# Altium project MiniPC MB GOST.PrjPcb (part 19 of 31)

## Sheet Ethernet HPS Connector.SchDoc
size 209 x 297 mm; Author: ALTIUM GOSTBOM2.0 KEV; SheetNumber: 11; SheetTotal: 48
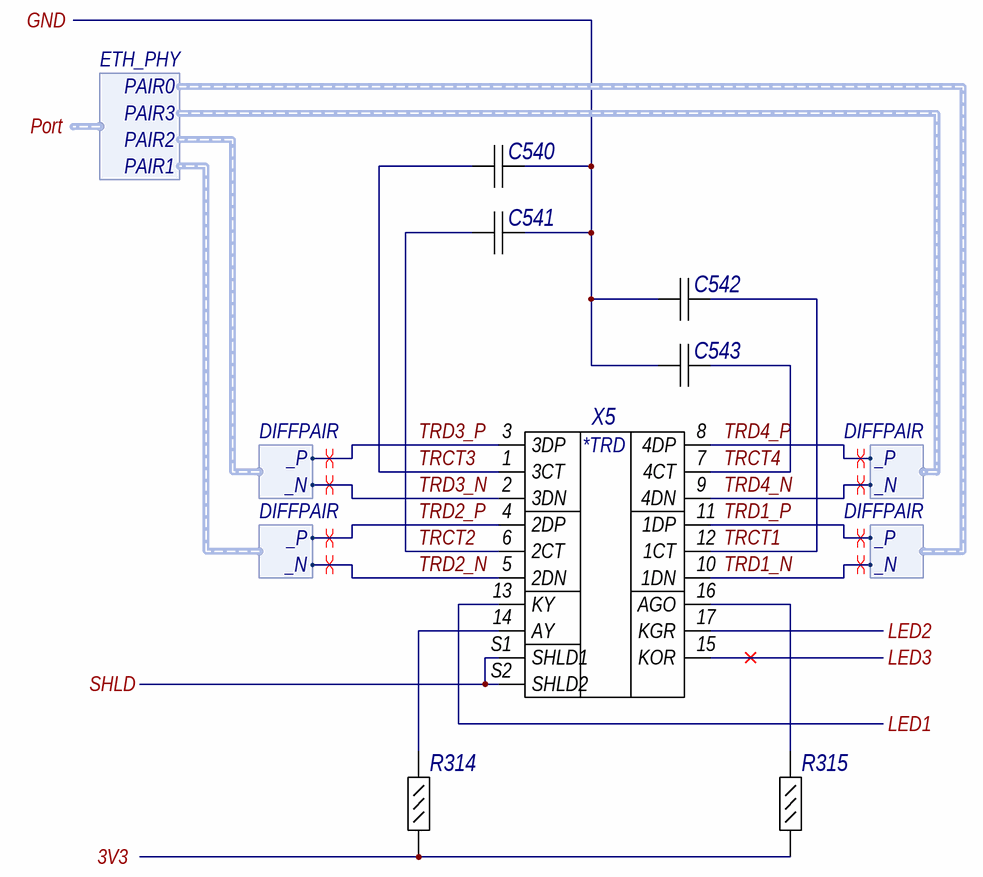
[diagram p24: Ethernet HPS Connector.SchDoc]

### Parts
C540  GRM155R71H103KA88D  [CAPC1005X55X25ML05T10]  (value not drawn)
C541  GRM155R71H103KA88D  [CAPC1005X55X25ML05T10]  (value not drawn)
C542  GRM155R71H103KA88D  [CAPC1005X55X25ML05T10]  (value not drawn)
C543  GRM155R71H103KA88D  [CAPC1005X55X25ML05T10]  (value not drawn)
R314  ERJ-2GEJ221X  [RESC1005X40X25LL05T05]  (value not drawn)
R315  ERJ-2GEJ221X  [RESC1005X40X25LL05T05]  (value not drawn)
X5  L829-1J1T-43  [BELS-L829-1J1T-43_V]  (value not drawn)

### Ports
3V3, GND, LED1, LED2, LED3, Port (harness ETH_PHY), SHLD

### Harnesses
ETH_PHY: PAIR0, PAIR1, PAIR2, PAIR3
DIFFPAIR: _P, _N

### Nets
GND: C540.1 C541.1 C542.1 C543.1 X5.S1(SHLD1) X5.S2(SHLD2) ; port SHLD, port GND
IO_3V3: R314.1 R315.1 ; port 3V3
TRCT1: C542.2 X5.12(1CT)  [project net TRCT1_11]
TRCT2: C541.2 X5.6(2CT)  [project net TRCT2_11]
TRCT3: C540.2 X5.1(3CT)  [project net TRCT3_11]
TRCT4: C543.2 X5.7(4CT)  [project net TRCT4_11]
TRD1_N: X5.10(1DN) ; harness DIFFPAIR._N
TRD1_P: X5.11(1DP) ; harness DIFFPAIR._P
TRD2_N: X5.5(2DN) ; harness DIFFPAIR._N
TRD2_P: X5.4(2DP) ; harness DIFFPAIR._P
TRD3_N: X5.2(3DN) ; harness DIFFPAIR._N
TRD3_P: X5.3(3DP) ; harness DIFFPAIR._P
TRD4_N: X5.9(4DN) ; harness DIFFPAIR._N
TRD4_P: X5.8(4DP) ; harness DIFFPAIR._P
NetD14_15: X5.17(KGR) ; port LED2
NetD14_17: X5.13(KY) ; port LED1
NetR314_2: R314.2 X5.14(AY)
NetR315_2: R315.2 X5.16(AGO)
NetX5_15: X5.15(KOR) ; port LED3

### Layout directives
differential pair: TRD1_N, TRD1_P, TRD2_N, TRD2_P, TRD3_N, TRD3_P, TRD4_N, TRD4_P

### Notes on the sheet
- Подп. дата
- Инв. № дубл.
- Взам. инв. №
- Подп. и дата
- Инв. № подл.
- Изм.
- Лист
- № докум.
- Подп.
- Дата
- Файл:
- ALTIUM GOSTBOM2.0 KEV
- Копировал
- Формат А4
- (in symbol E38) *TRD

### Library data of the parts
C540 = E3: Chip Capacitor, 10 nF, +/- 10%, 50 V, -55 to 125 degC, 0402 (1005 Metric), RoHS, Tape and Reel; Manufacturer: Basic Passives; Тип элемента: Конденсатор; Capacitance: 10 nF; Case\/Package: 0402; Type (Capacitors): X7R; Voltage Rating: 50 V; Old_des: C364; New_des: C540; UID: E3; Component Kind: Standard; Case Code (Imperial): 0402; Case Code (Metric): 1005; ComponentLink1Description: Manufacturer URL; ComponentLink1URL: http://www.murata.com/; ComponentLink2Description: Datasheet; ComponentLink2URL: http://search.murata.co.jp/Ceramy/image/img/A01X/G101/ENG/GRM155R71H103KA88-01.pdf; DatasheetVersion: 02/2016; Length: 1 mm; Max Operating Temperature: 125 degC; Min Operating Temperature: -55 degC; Mounting Technology: Surface Mount; Package Quantity: 10000; PackageDescription: 2-Pin Surface Mount Device, Body 1 x 0.5 mm; Packaging: Tape and Reel; PartNumber: GRM155R71H103KA88D; RoHSCompliant: true; Tolerance: 10%; Width: 0.5 mm; Height: 0.5 mm; Lead Pitch: 2mm; Mount: Surface Mount; PackageReference: 0402; Pins: 2; Radiation Hardening: No; REACH SVHC: No SVHC; Voltage Rating (DC): 50 V; ClassName: AB21
C541 = E3: Chip Capacitor, 10 nF, +/- 10%, 50 V, -55 to 125 degC, 0402 (1005 Metric), RoHS, Tape and Reel; Manufacturer: Basic Passives; Тип элемента: Конденсатор; Capacitance: 10 nF; Case\/Package: 0402; Type (Capacitors): X7R; Voltage Rating: 50 V; Old_des: C363; New_des: C541; UID: E3; Component Kind: Standard; Case Code (Imperial): 0402; Case Code (Metric): 1005; ComponentLink1Description: Manufacturer URL; ComponentLink1URL: http://www.murata.com/; ComponentLink2Description: Datasheet; ComponentLink2URL: http://search.murata.co.jp/Ceramy/image/img/A01X/G101/ENG/GRM155R71H103KA88-01.pdf; DatasheetVersion: 02/2016; Length: 1 mm; Max Operating Temperature: 125 degC; Min Operating Temperature: -55 degC; Mounting Technology: Surface Mount; Package Quantity: 10000; PackageDescription: 2-Pin Surface Mount Device, Body 1 x 0.5 mm; Packaging: Tape and Reel; PartNumber: GRM155R71H103KA88D; RoHSCompliant: true; Tolerance: 10%; Width: 0.5 mm; Height: 0.5 mm; Lead Pitch: 2mm; Mount: Surface Mount; PackageReference: 0402; Pins: 2; Radiation Hardening: No; REACH SVHC: No SVHC; Voltage Rating (DC): 50 V; ClassName: AB21
C542 = E3: Chip Capacitor, 10 nF, +/- 10%, 50 V, -55 to 125 degC, 0402 (1005 Metric), RoHS, Tape and Reel; Manufacturer: Basic Passives; Тип элемента: Конденсатор; Capacitance: 10 nF; Case\/Package: 0402; Type (Capacitors): X7R; Voltage Rating: 50 V; Old_des: C362; New_des: C542; UID: E3; Component Kind: Standard; Case Code (Imperial): 0402; Case Code (Metric): 1005; ComponentLink1Description: Manufacturer URL; ComponentLink1URL: http://www.murata.com/; ComponentLink2Description: Datasheet; ComponentLink2URL: http://search.murata.co.jp/Ceramy/image/img/A01X/G101/ENG/GRM155R71H103KA88-01.pdf; DatasheetVersion: 02/2016; Length: 1 mm; Max Operating Temperature: 125 degC; Min Operating Temperature: -55 degC; Mounting Technology: Surface Mount; Package Quantity: 10000; PackageDescription: 2-Pin Surface Mount Device, Body 1 x 0.5 mm; Packaging: Tape and Reel; PartNumber: GRM155R71H103KA88D; RoHSCompliant: true; Tolerance: 10%; Width: 0.5 mm; Height: 0.5 mm; Lead Pitch: 2mm; Mount: Surface Mount; PackageReference: 0402; Pins: 2; Radiation Hardening: No; REACH SVHC: No SVHC; Voltage Rating (DC): 50 V; ClassName: AB21
C543 = E3: Chip Capacitor, 10 nF, +/- 10%, 50 V, -55 to 125 degC, 0402 (1005 Metric), RoHS, Tape and Reel; Manufacturer: Basic Passives; Тип элемента: Конденсатор; Capacitance: 10 nF; Case\/Package: 0402; Type (Capacitors): X7R; Voltage Rating: 50 V; Old_des: C365; New_des: C543; UID: E3; Component Kind: Standard; Case Code (Imperial): 0402; Case Code (Metric): 1005; ComponentLink1Description: Manufacturer URL; ComponentLink1URL: http://www.murata.com/; ComponentLink2Description: Datasheet; ComponentLink2URL: http://search.murata.co.jp/Ceramy/image/img/A01X/G101/ENG/GRM155R71H103KA88-01.pdf; DatasheetVersion: 02/2016; Length: 1 mm; Max Operating Temperature: 125 degC; Min Operating Temperature: -55 degC; Mounting Technology: Surface Mount; Package Quantity: 10000; PackageDescription: 2-Pin Surface Mount Device, Body 1 x 0.5 mm; Packaging: Tape and Reel; PartNumber: GRM155R71H103KA88D; RoHSCompliant: true; Tolerance: 10%; Width: 0.5 mm; Height: 0.5 mm; Lead Pitch: 2mm; Mount: Surface Mount; PackageReference: 0402; Pins: 2; Radiation Hardening: No; REACH SVHC: No SVHC; Voltage Rating (DC): 50 V; ClassName: AB21
R314 = E101: Chip Resistor, 220 Ohm, +/- 5%, 100 mW, -55 to 155 degC, 0402 (1005 Metric), RoHS, Tape and Reel; Manufacturer: Basic Passives; Тип элемента: Резистор; Case\/Package: 0402; Voltage Rating: 50 V; Power Rating: 100 mW; Resistance: 220 Ohm; Old_des: R297; New_des: R314; UID: E101; Component Kind: Standard; Case Code (Imperial): 0402; Case Code (Metric): 1005; ComponentLink1Description: Manufacturer URL; ComponentLink1URL: http://www.panasonic.com/; ComponentLink2Description: Datasheet; ComponentLink2URL: http://industrial.panasonic.com/cdbs/www-data/pdf/RDA0000/AOA0000C84.pdf; DatasheetVersion: 04/2015; Length: 1 mm; Max Operating Temperature: 155 degC; Min Operating Temperature: -55 degC; Mounting Technology: Surface Mount; Package Quantity: 10000; PackageDescription: 2-Pin Surface Mount Device, Body 1 x 0.5 mm; Packaging: Tape and Reel; PartNumber: ERJ-2GEJ221X; RoHSCompliant: true; Tolerance: 5%; Width: 0.5 mm; Height: 0.35 mm; Mount: Surface Mount; PackageReference: 0402; Pins: 2; Radiation Hardening: No; REACH SVHC: Unknown; ClassName: AB21
R315 = E101: Chip Resistor, 220 Ohm, +/- 5%, 100 mW, -55 to 155 degC, 0402 (1005 Metric), RoHS, Tape and Reel; Manufacturer: Basic Passives; Тип элемента: Резистор; Case\/Package: 0402; Voltage Rating: 50 V; Power Rating: 100 mW; Resistance: 220 Ohm; Old_des: R298; New_des: R315; UID: E101; Component Kind: Standard; Case Code (Imperial): 0402; Case Code (Metric): 1005; ComponentLink1Description: Manufacturer URL; ComponentLink1URL: http://www.panasonic.com/; ComponentLink2Description: Datasheet; ComponentLink2URL: http://industrial.panasonic.com/cdbs/www-data/pdf/RDA0000/AOA0000C84.pdf; DatasheetVersion: 04/2015; Length: 1 mm; Max Operating Temperature: 155 degC; Min Operating Temperature: -55 degC; Mounting Technology: Surface Mount; Package Quantity: 10000; PackageDescription: 2-Pin Surface Mount Device, Body 1 x 0.5 mm; Packaging: Tape and Reel; PartNumber: ERJ-2GEJ221X; RoHSCompliant: true; Tolerance: 5%; Width: 0.5 mm; Height: 0.35 mm; Mount: Surface Mount; PackageReference: 0402; Pins: 2; Radiation Hardening: No; REACH SVHC: Unknown; ClassName: AB21
X5 = E38: Gigabit MagJack(R) Ultra Low Profile, 10/100/1000 Base-T, 19-Pin THD, RoHS, Tray; Тип элемента: Соединитель; Old_des: J11; New_des: X5; UID: E38; Component Kind: Standard; ComponentLink1Description: Manufacturer URL; ComponentLink1URL: http://belfuse.com/ethernet/; ComponentLink2Description: Datasheet; ComponentLink2URL: http://belfuse.com/pdfs/L829-1J1T-43.pdf; DatasheetVersion: Rev. G; Length: 17.78 mm; Mounting Technology: Through Hole; PackageDescription: 19-Pin Through Hole Device, Body 23.94 x 17.58 mm, Pitch 2.03 mm; Packaging: Tray; PartNumber: L829-1J1T-43; RoHSCompliant: True; Height: 11.3 mm; Mount: Through Hole; Pins: 8; Case/Package: Metal; Package Quantity: 60; Width: 24.13 mm; ClassName: AB21

## Sheet JTAG Connector.SchDoc
size 209 x 297 mm; Author: ALTIUM GOSTBOM2.0 KEV; SheetNumber: 14; SheetTotal: 48
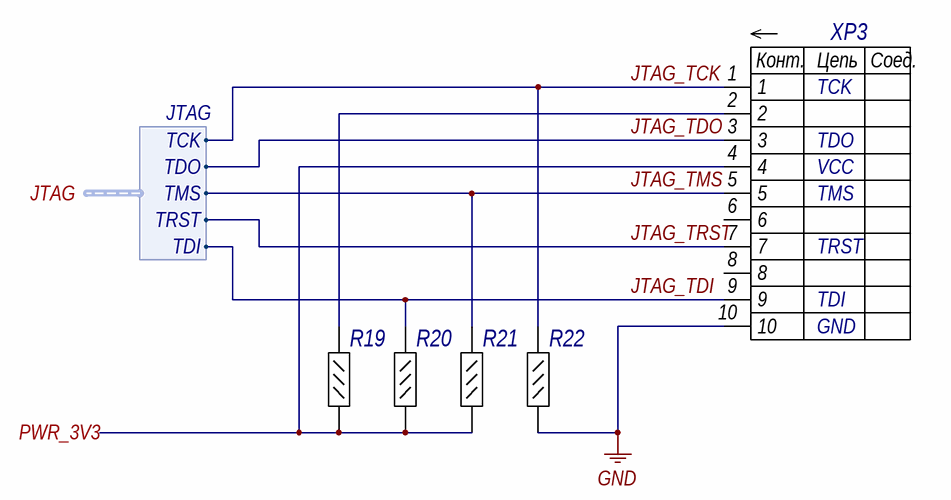
[diagram p25: JTAG Connector.SchDoc]

### Parts
R19  ERJ-2RKF1001X  [RESC1005X40X25LL05T05]  (value not drawn)
R20  ERJ-2RKF1001X  [RESC1005X40X25LL05T05]  (value not drawn)
R21  ERJ-2RKF1001X  [RESC1005X40X25LL05T05]  (value not drawn)
R22  ERJ-2RKF1001X  [RESC1005X40X25LL05T05]  (value not drawn)
XP3  TSM-105-01-T-DV-TR  [SMTC-TSM-105-01-T-DV_V]  (value not drawn)

### Ports
JTAG (harness JTAG), PWR_3V3

### Harnesses
JTAG: TCK, TDO, TMS, TRST, TDI

### Nets
GND: R22.1 XP3.10
3V3: R19.2 R20.1 R21.1 XP3.4 ; port PWR_3V3
JTAG_TCK: R22.2 XP3.1 ; port JTAG.TCK
JTAG_TDI: R20.2 XP3.9 ; port JTAG.TDI
JTAG_TDO: XP3.3 ; port JTAG.TDO
JTAG_TMS: R21.2 XP3.5 ; port JTAG.TMS
JTAG_TRST: XP3.7 ; port JTAG.TRST
NetR19_1: R19.1 XP3.2

Not connected (* = marked no-connect by the designer): XP3 6 8

### Notes on the sheet
- TCK
- TDO
- TMS
- VCC
- TRST
- TDI
- GND
- Подп. дата
- Инв. № дубл.
- Взам. инв. №
- Подп. и дата
- Инв. № подл.
- Изм.
- Лист
- № докум.
- Подп.
- Дата
- Файл:
- ALTIUM GOSTBOM2.0 KEV
- Копировал
- Формат А4
- (in symbol E39) Конт.; Цепь; Соед.

### Library data of the parts
R19 = E59: Chip Resistor, 1 KOhm, +/- 1%, 100 mW, -55 to 155 degC, 0402 (1005 Metric), RoHS, Tape and Reel; Manufacturer: Basic Passives; Тип элемента: Резистор; Case\/Package: 0402; Voltage Rating: 50 V; Power Rating: 100 mW; Resistance: 1 KOhm; Old_des: R329; New_des: R19; UID: E59; Component Kind: Standard; Case Code (Imperial): 0402; Case Code (Metric): 1005; ComponentLink1Description: Manufacturer URL; ComponentLink1URL: http://www.panasonic.com/; ComponentLink2Description: Datasheet; ComponentLink2URL: http://industrial.panasonic.com/cdbs/www-data/pdf/RDA0000/AOA0000C86.pdf; DatasheetVersion: 04/2015; Length: 1 mm; Max Operating Temperature: 155 degC; Min Operating Temperature: -55 degC; Mounting Technology: Surface Mount; Package Quantity: 10000; PackageDescription: 2-Pin Surface Mount Device, Body 1 x 0.5 mm; Packaging: Tape and Reel; PartNumber: ERJ-2RKF1001X; RoHSCompliant: true; Tolerance: 1%; Width: 0.5 mm; Height: 0.35 mm; Mount: Surface Mount; PackageReference: 0402; Pins: 2; Radiation Hardening: No; REACH SVHC: Yes
R20 = E59: Chip Resistor, 1 KOhm, +/- 1%, 100 mW, -55 to 155 degC, 0402 (1005 Metric), RoHS, Tape and Reel; Manufacturer: Basic Passives; Тип элемента: Резистор; Case\/Package: 0402; Voltage Rating: 50 V; Power Rating: 100 mW; Resistance: 1 KOhm; Old_des: R330; New_des: R20; UID: E59; Component Kind: Standard; Case Code (Imperial): 0402; Case Code (Metric): 1005; ComponentLink1Description: Manufacturer URL; ComponentLink1URL: http://www.panasonic.com/; ComponentLink2Description: Datasheet; ComponentLink2URL: http://industrial.panasonic.com/cdbs/www-data/pdf/RDA0000/AOA0000C86.pdf; DatasheetVersion: 04/2015; Length: 1 mm; Max Operating Temperature: 155 degC; Min Operating Temperature: -55 degC; Mounting Technology: Surface Mount; Package Quantity: 10000; PackageDescription: 2-Pin Surface Mount Device, Body 1 x 0.5 mm; Packaging: Tape and Reel; PartNumber: ERJ-2RKF1001X; RoHSCompliant: true; Tolerance: 1%; Width: 0.5 mm; Height: 0.35 mm; Mount: Surface Mount; PackageReference: 0402; Pins: 2; Radiation Hardening: No; REACH SVHC: Yes
R21 = E59: Chip Resistor, 1 KOhm, +/- 1%, 100 mW, -55 to 155 degC, 0402 (1005 Metric), RoHS, Tape and Reel; Manufacturer: Basic Passives; Тип элемента: Резистор; Case\/Package: 0402; Voltage Rating: 50 V; Power Rating: 100 mW; Resistance: 1 KOhm; Old_des: R331; New_des: R21; UID: E59; Component Kind: Standard; Case Code (Imperial): 0402; Case Code (Metric): 1005; ComponentLink1Description: Manufacturer URL; ComponentLink1URL: http://www.panasonic.com/; ComponentLink2Description: Datasheet; ComponentLink2URL: http://industrial.panasonic.com/cdbs/www-data/pdf/RDA0000/AOA0000C86.pdf; DatasheetVersion: 04/2015; Length: 1 mm; Max Operating Temperature: 155 degC; Min Operating Temperature: -55 degC; Mounting Technology: Surface Mount; Package Quantity: 10000; PackageDescription: 2-Pin Surface Mount Device, Body 1 x 0.5 mm; Packaging: Tape and Reel; PartNumber: ERJ-2RKF1001X; RoHSCompliant: true; Tolerance: 1%; Width: 0.5 mm; Height: 0.35 mm; Mount: Surface Mount; PackageReference: 0402; Pins: 2; Radiation Hardening: No; REACH SVHC: Yes
R22 = E59: Chip Resistor, 1 KOhm, +/- 1%, 100 mW, -55 to 155 degC, 0402 (1005 Metric), RoHS, Tape and Reel; Manufacturer: Basic Passives; Тип элемента: Резистор; Case\/Package: 0402; Voltage Rating: 50 V; Power Rating: 100 mW; Resistance: 1 KOhm; Old_des: R328; New_des: R22; UID: E59; Component Kind: Standard; Case Code (Imperial): 0402; Case Code (Metric): 1005; ComponentLink1Description: Manufacturer URL; ComponentLink1URL: http://www.panasonic.com/; ComponentLink2Description: Datasheet; ComponentLink2URL: http://industrial.panasonic.com/cdbs/www-data/pdf/RDA0000/AOA0000C86.pdf; DatasheetVersion: 04/2015; Length: 1 mm; Max Operating Temperature: 155 degC; Min Operating Temperature: -55 degC; Mounting Technology: Surface Mount; Package Quantity: 10000; PackageDescription: 2-Pin Surface Mount Device, Body 1 x 0.5 mm; Packaging: Tape and Reel; PartNumber: ERJ-2RKF1001X; RoHSCompliant: true; Tolerance: 1%; Width: 0.5 mm; Height: 0.35 mm; Mount: Surface Mount; PackageReference: 0402; Pins: 2; Radiation Hardening: No; REACH SVHC: Yes
XP3 = E39: Male Header, Pitch 2.54 mm, 2 x 5 Position, Height 9.65 mm, -55 to 105 degC, RoHS, Tape and Reel; Тип элемента: Соединитель; Old_des: J12; New_des: XP3; UID: E39; Component Kind: Standard; ComponentLink1Description: Manufacturer URL; ComponentLink1URL: http://www.samtec.com/; ComponentLink2Description: Datasheet; ComponentLink2URL: http://suddendocs.samtec.com/catalog_english/tsm.pdf; DatasheetVersion: Rev. 31DEC15; Length: 12.7 mm; Max Operating Temperature: 105 degC; Min Operating Temperature: -55 degC; Mounting Technology: Surface Mount; PackageDescription: Male Header, Pitch 2.54 mm, 2 x 5 Position, Height 9.65 mm; Packaging: Tape and Reel; PartNumber: TSM-105-01-T-DV-TR; RoHSCompliant: True; Height: 9.65 mm; Mount: Surface Mount; Pins: 10; Radiation Hardening: No; REACH SVHC: No SVHC; ComponentLink3Description: Package Specification; ComponentLink3URL: http://suddendocs.samtec.com/prints/tsm-dv-footprint.pdf

## Sheet miniPCIE Connector.SchDoc
size 420 x 297 mm; Author: ALTIUM GOSTBOM2.0 KEV; SheetNumber: 15; SheetTotal: 48
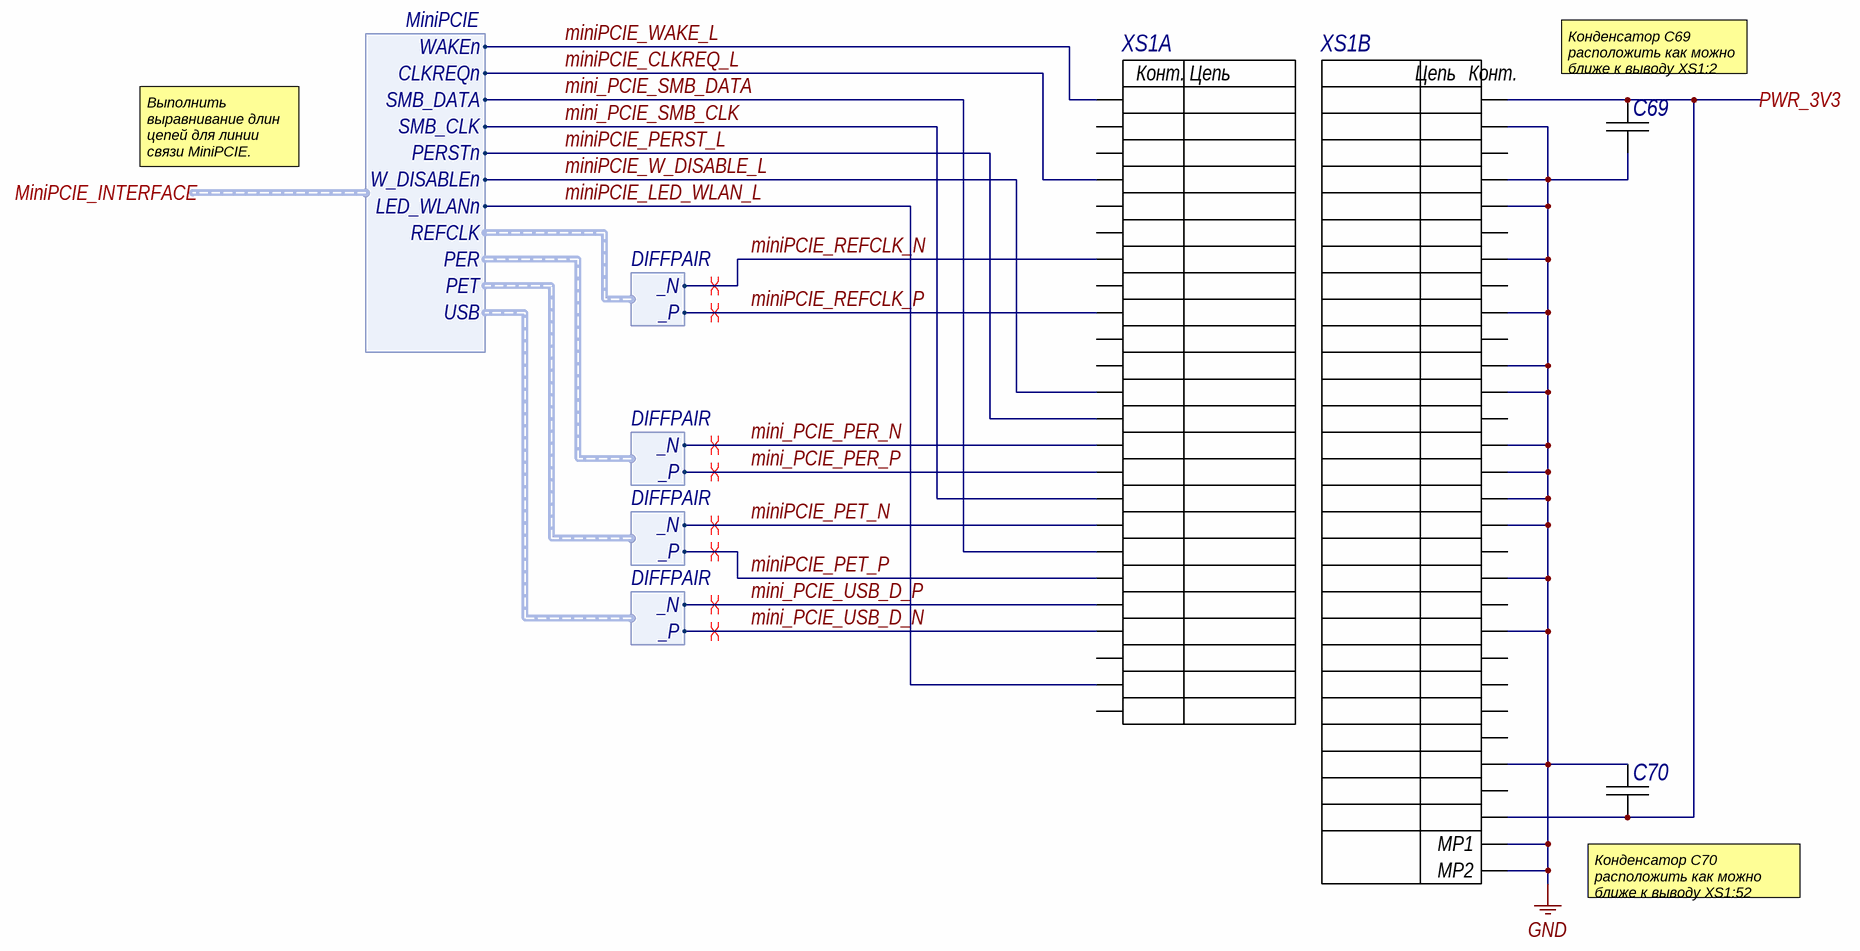
[diagram p26: miniPCIE Connector.SchDoc]

### Parts
C69  C1005X7R1E104M  [CAPC1005X55X10LL05]  (value not drawn)
C70  C1005X7R1E104M  [CAPC1005X55X10LL05]  (value not drawn)
XS1  292443-1  [BTB-SM0-8-2H52F]  (value not drawn)  (parts A,B of 2)

### Ports
MiniPCIE_INTERFACE (harness MiniPCIE), PWR_3V3

### Harnesses
DIFFPAIR: _P, _N
MiniPCIE: WAKEn, CLKREQn, SMB_DATA, SMB_CLK, PERSTn, W_DISABLEn, LED_WLANn, REFCLK, PER, PET, USB

### Nets
GND: C69.1 C70.2 XS1.4(GND) XS1.9(GND) XS1.15(GND) XS1.18(GND) XS1.21(GND) XS1.26(GND) XS1.27(GND) XS1.29(GND) XS1.34(GND) XS1.35(GND) XS1.37(GND) XS1.40(GND) XS1.43(GND) XS1.50(GND) XS1.MP1 XS1.MP2
3V3: C69.2 C70.1 XS1.2(3,3Vaux) XS1.52(3,3Vaux) ; port PWR_3V3
mini_PCIE_PER_N: XS1.23(PERnO) ; harness DIFFPAIR._N
mini_PCIE_PER_P: XS1.25(PERpO) ; harness DIFFPAIR._P
mini_PCIE_SMB_CLK: XS1.30(SMB_CLK) ; port MiniPCIE_INTERFACE.SMB_CLK
mini_PCIE_SMB_DATA: XS1.32(SM8_DATA) ; port MiniPCIE_INTERFACE.SMB_DATA
mini_PCIE_USB_D_N: XS1.38(USB_D+) ; harness DIFFPAIR._P
mini_PCIE_USB_D_P: XS1.36(USB_D-) ; harness DIFFPAIR._N
miniPCIE_CLKREQ_L: XS1.7(CLKREQ#) ; port MiniPCIE_INTERFACE.CLKREQn
miniPCIE_LED_WLAN_L: XS1.44(LED_WLAN#) ; port MiniPCIE_INTERFACE.LED_WLANn
miniPCIE_PERST_L: XS1.22(PERST#) ; port MiniPCIE_INTERFACE.PERSTn
miniPCIE_PET_N: XS1.31(PETnO) ; harness DIFFPAIR._N
miniPCIE_PET_P: XS1.33(PETpO) ; harness DIFFPAIR._P
miniPCIE_REFCLK_N: XS1.11(REFCLK-) ; harness DIFFPAIR._N
miniPCIE_REFCLK_P: XS1.13(REFCLK_+) ; harness DIFFPAIR._P
miniPCIE_W_DISABLE_L: XS1.20(W.DISABLE#) ; port MiniPCIE_INTERFACE.W_DISABLEn
miniPCIE_WAKE_L: XS1.1(WAKE#) ; port MiniPCIE_INTERFACE.WAKEn

Not connected (* = marked no-connect by the designer): XS1 3(COE_XI) 5(COEX2) 6(1,5V) 8(UIM.PWR) 10(UIM_DATA) 12(UIM_CLK) 14(UIM.RESET) 16(UIM_VPP) 17(Reserved) 19(Reserved) 24(3,3Vaux) 28(1,5V) 39(3,3Vaux) 41(3,3Vaux) 42(LED.WWAN#) 45(Reserved) 46(LED_WPAN#) 47(Reserved) 48(1,5V) 49(Reserved) 51(Reserved)

### Layout directives
differential pair: mini_PCIE_PER_N, mini_PCIE_PER_P, mini_PCIE_USB_D_N, mini_PCIE_USB_D_P, miniPCIE_PET_N, miniPCIE_PET_P, miniPCIE_REFCLK_N, miniPCIE_REFCLK_P

### Notes on the sheet
- (near C69) Конденсатор C69 расположить как можно ближе к выводу XS1:2
- Выполнить выравнивание длин цепей для линии связи MiniPCIE.
- (near C70) Конденсатор C70 расположить как можно ближе к выводу XS1:52
- Подп. дата
- Инв. № дубл.
- Взам. инв. №
- Подп. и дата
- Инв. № подл.
- Изм.
- Лист
- № докум.
- Подп.
- Дата
- ALTIUM GOSTBOM2.0 KEV
- Файл:
- Копировал
- Формат А3
- (in symbol E40, part A) Конт.; Цепь
- (in symbol E40, part B) Цепь; Конт.

### Library data of the parts
C69 = E11: Chip Capacitor, 0.1 uF, +/- 20%, 25 V, -55 to 125 degC, 0402 (1005 Metric), RoHS, Tape and Reel; Тип элемента: Конденсатор; Capacitance: 100 nF; Case\/Package: 0402; Type (Capacitors): X7R; Voltage Rating: 25 V; Old_des: C481; New_des: C69; UID: E11; Component Kind: Standard; Case Code (Imperial): 0402; Case Code (Metric): 1005; ComponentLink1Description: Manufacturer URL; ComponentLink1URL: http://www.tdk.com/; ComponentLink2Description: Datasheet; ComponentLink2URL: http://www.farnell.com/datasheets/1571323.pdf; DatasheetVersion: 09/2011; Length: 1 mm; Max Operating Temperature: 125 degC; Min Operating Temperature: -55 degC; Mounting Technology: Surface Mount; Package Quantity: 10000; PackageDescription: 2-Pin Surface Mount Device, Body 1 x 0.5 mm; Packaging: Tape and Reel; PartNumber: C1005X7R1E104M; RoHSCompliant: true; Tolerance: 20%; Width: 0.5 mm; Height: 0.5 mm; Mount: Surface Mount; PackageReference: 0402; Pins: 2; Voltage Rating (DC): 25 V
C70 = E11: Chip Capacitor, 0.1 uF, +/- 20%, 25 V, -55 to 125 degC, 0402 (1005 Metric), RoHS, Tape and Reel; Тип элемента: Конденсатор; Capacitance: 100 nF; Case\/Package: 0402; Type (Capacitors): X7R; Voltage Rating: 25 V; Old_des: C482; New_des: C70; UID: E11; Component Kind: Standard; Case Code (Imperial): 0402; Case Code (Metric): 1005; ComponentLink1Description: Manufacturer URL; ComponentLink1URL: http://www.tdk.com/; ComponentLink2Description: Datasheet; ComponentLink2URL: http://www.farnell.com/datasheets/1571323.pdf; DatasheetVersion: 09/2011; Length: 1 mm; Max Operating Temperature: 125 degC; Min Operating Temperature: -55 degC; Mounting Technology: Surface Mount; Package Quantity: 10000; PackageDescription: 2-Pin Surface Mount Device, Body 1 x 0.5 mm; Packaging: Tape and Reel; PartNumber: C1005X7R1E104M; RoHSCompliant: true; Tolerance: 20%; Width: 0.5 mm; Height: 0.5 mm; Mount: Surface Mount; PackageReference: 0402; Pins: 2; Voltage Rating (DC): 25 V
XS1 = E40: Board-to-Board Connector, SMT, Right Angle, Pitch 0.8mm, 52-Position, Female; Тип элемента: Соединитель; Mating Connector: PCIeMini-CN-2S-M-R52; Old_des: J13; New_des: XS1; UID: E40; Component Kind: Standard; ComponentLink1Description: Manufacturer URL; ComponentLink1URL: https://www.te.com/; ComponentLink2Description: Datasheet; ComponentLink2URL: https://www.te.com/commerce/DocumentDelivery/DDEController?Action=showdoc&DocId=Customer+Drawing%7F292443%7FC1%7Fpdf%7FEnglish%7FENG_CD_292443_C1.pdf%7F292443-1; System: Connector; ClassName: Board Template Connector; Datasheet Version: Oct-2006; Package Reference: BTB-SM0-8-2H52F; Publisher: Altium